# Altium schematic sheet Jumper.SchDoc
size Tabloid
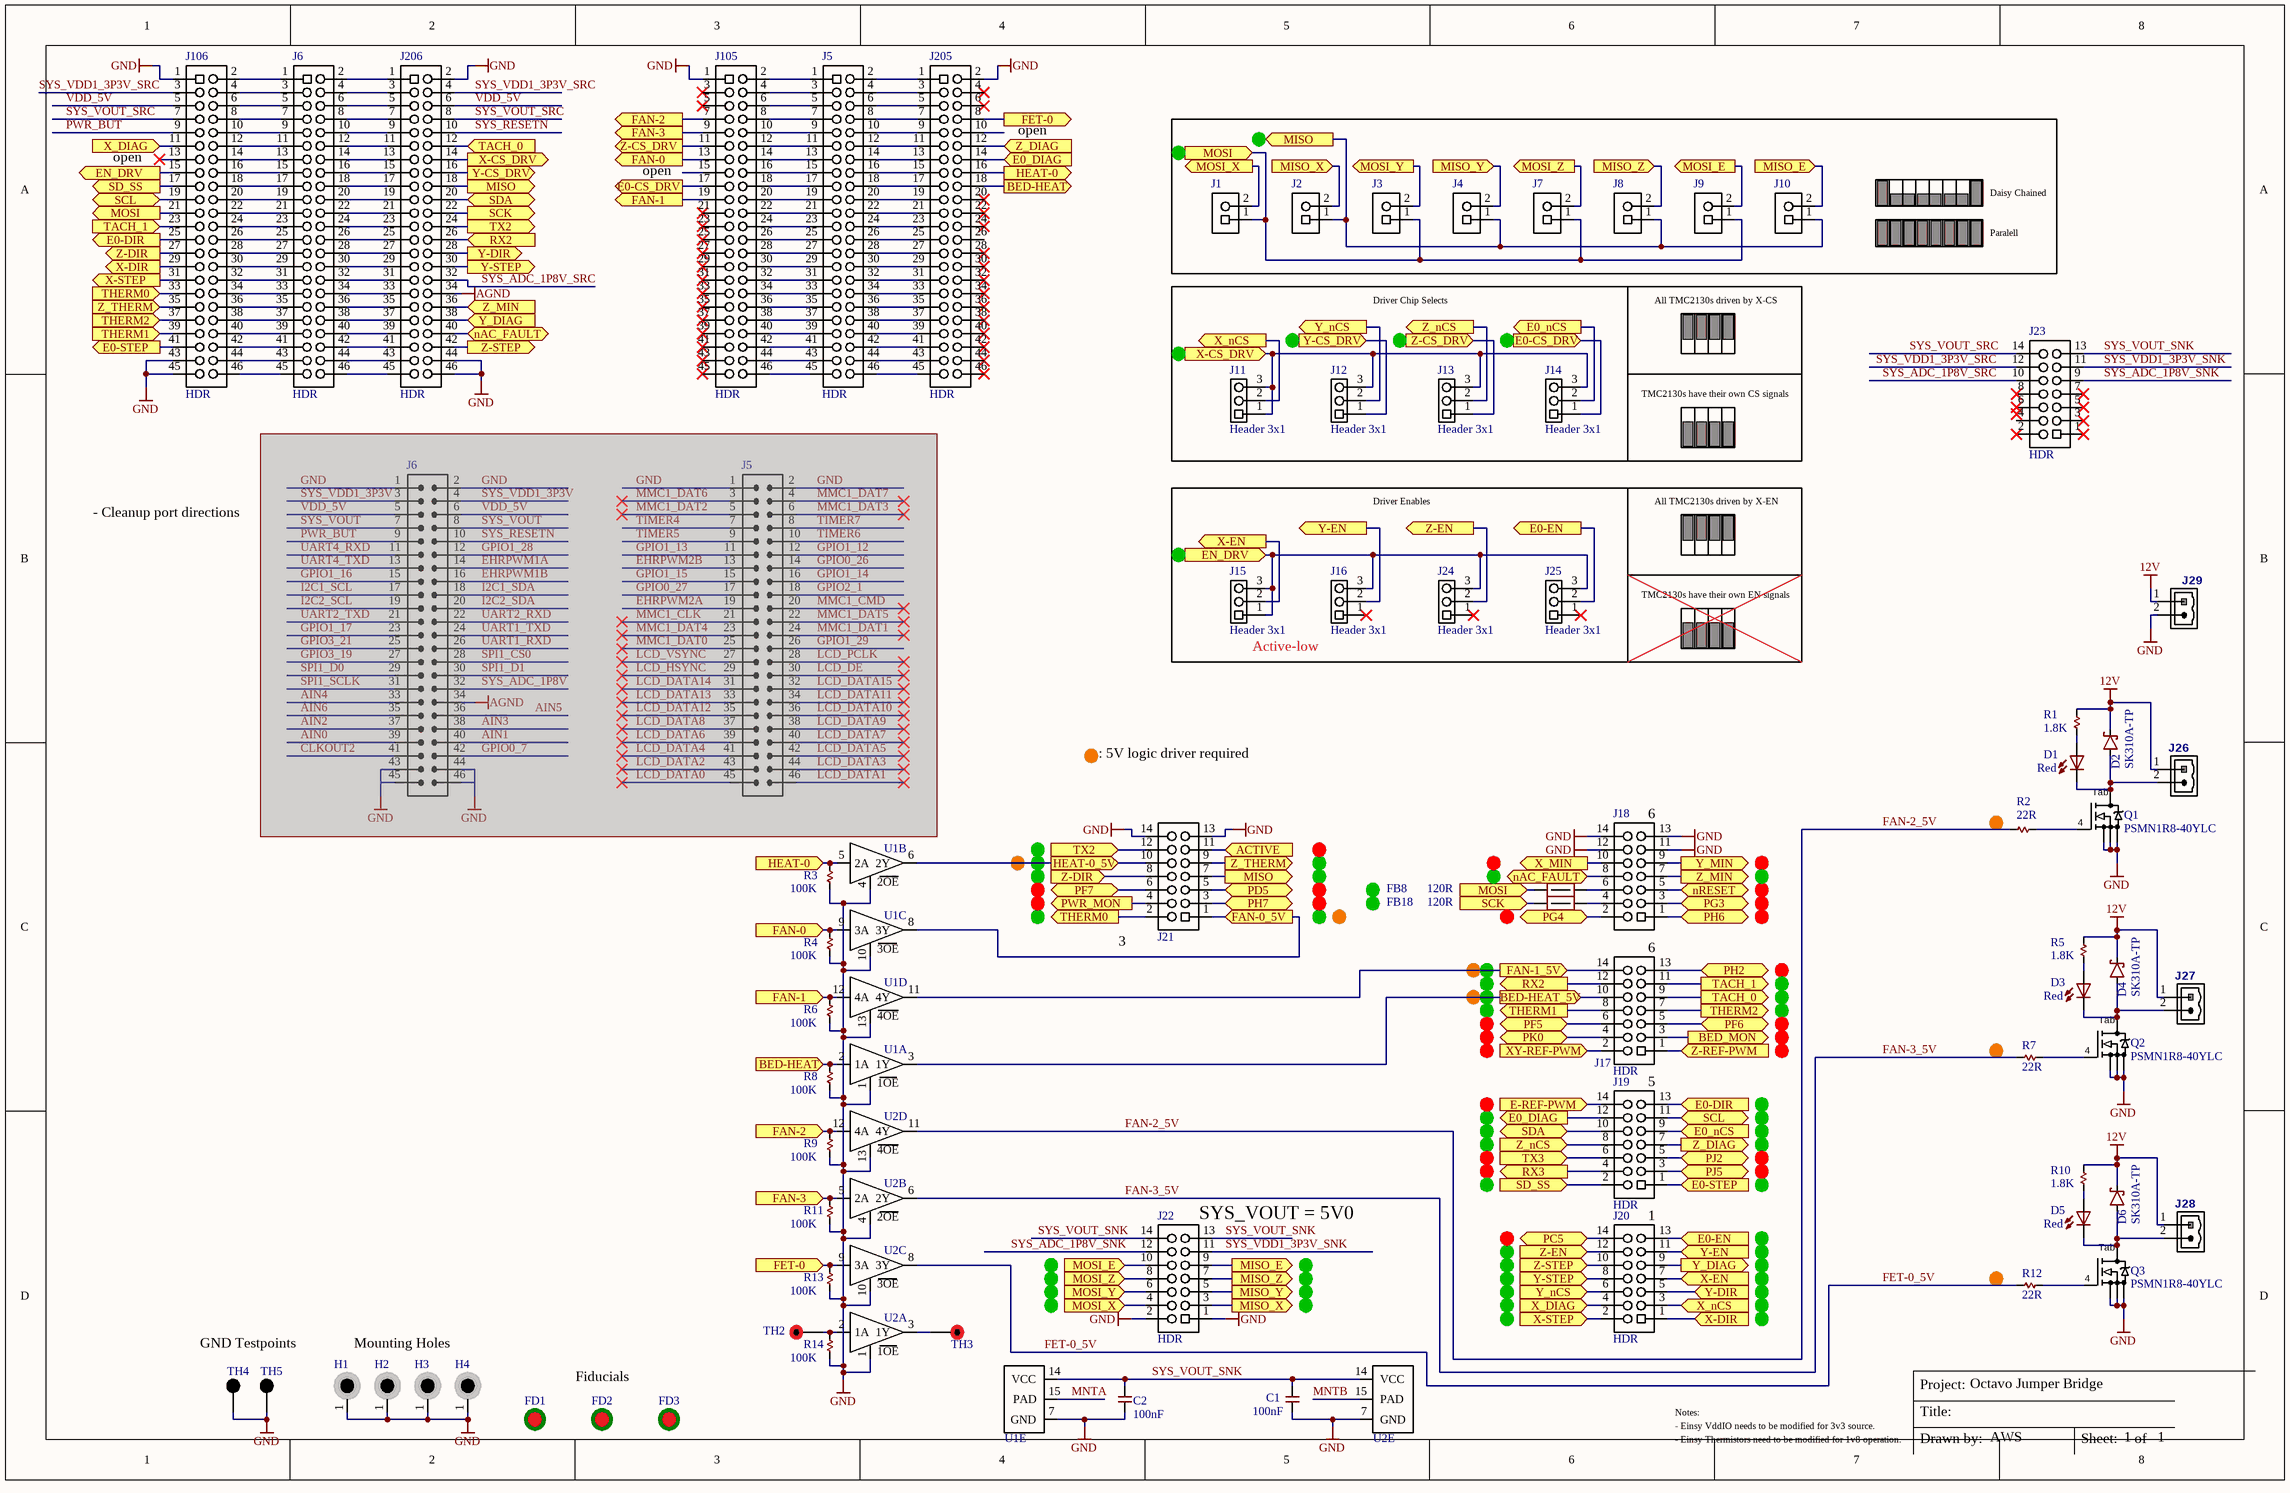
[diagram p0: Jumper.SchDoc]

## Parts
(Parts that share a designator on the sheet are numbered #1, #2 ... from top to bottom, then left to right.)
C1  100nF  [C0603]
C2  100nF  [C0603]
D1  Red  [LED2012120]
D2  SK310A-TP  [SMA-SM]
D3  Red  [LED2012120]
D4  SK310A-TP  [SMA-SM]
D5  Red  [LED2012120]
D6  SK310A-TP  [SMA-SM]
FB8  120R  [R0402]
FB18  120R  [R0402]
FD1  FIDUCIAL  [FIDUCIAL-1X2]  (value not drawn)
FD2  FIDUCIAL  [FIDUCIAL-1X2]  (value not drawn)
FD3  FIDUCIAL  [FIDUCIAL-1X2]  (value not drawn)
H1  Hole_DS  [Wave_hole_3x7-doubleSided]  (value not drawn)  (no BOM)
H2  Hole_DS  [Wave_hole_3x7-doubleSided]  (value not drawn)  (no BOM)
H3  Hole_DS  [Wave_hole_3x7-doubleSided]  (value not drawn)  (no BOM)
H4  Hole_DS  [Wave_hole_3x7-doubleSided]  (value not drawn)  (no BOM)
J1  Header 2x1  [HDR2X1]  (value not drawn)
J2  Header 2x1  [HDR2X1]  (value not drawn)
J3  Header 2x1  [HDR2X1]  (value not drawn)
J4  Header 2x1  [HDR2X1]  (value not drawn)
J5#1  HDR  [HDR2X23_ALT_PINOUT]
J5#2  HDR46  (value not drawn)  (masked out: inside a compile mask, not in the netlist)
J6#1  HDR  [HDR2X23_ALT_PINOUT]
J6#2  HDR46  (value not drawn)  (masked out: inside a compile mask, not in the netlist)
J7  Header 2x1  [HDR2X1]  (value not drawn)
J8  Header 2x1  [HDR2X1]  (value not drawn)
J9  Header 2x1  [HDR2X1]  (value not drawn)
J10  Header 2x1  [HDR2X1]  (value not drawn)
J11  Header 3x1  [HDR3X1]
J12  Header 3x1  [HDR3X1]
J13  Header 3x1  [HDR3X1]
J14  Header 3x1  [HDR3X1]
J15  Header 3x1  [HDR3X1]
J16  Header 3x1  [HDR3X1]
J17  HDR  [HDR2X7_ALT_PINOUT]
J18  HDR  [HDR2X7_ALT_PINOUT]  (value not drawn)
J19  HDR  [HDR2X7_ALT_PINOUT]
J20  HDR  [HDR2X7_ALT_PINOUT]
J21  HDR  [HDR2X7_ALT_PINOUT]  (value not drawn)
J22  HDR  [HDR2X7_ALT_PINOUT]
J23  HDR  [HDR2X7]
J24  Header 3x1  [HDR3X1]
J25  Header 3x1  [HDR3X1]
J26  0395311002  [MSTBV2]  (value not drawn)
J27  0395311002  [MSTBV2]  (value not drawn)
J28  0395311002  [MSTBV2]  (value not drawn)
J29  0395311002  [MSTBV2]  (value not drawn)
J105  HDR  [HDR2X23]
J106  HDR  [HDR2X23]
J205  HDR  [HDR2X23]
J206  HDR  [HDR2X23]
Q1  PSMN1R8-40YLC  [SOT669]
Q2  PSMN1R8-40YLC  [SOT669]
Q3  PSMN1R8-40YLC  [SOT669]
R1  1.8K  [R0603]
R2  22R  [R0805]
R3  100K  [R0402]
R4  100K  [R0402]
R5  1.8K  [R0603]
R6  100K  [R0402]
R7  22R  [R0805]
R8  100K  [R0402]
R9  100K  [R0402]
R10  1.8K  [R0603]
R11  100K  [R0402]
R12  22R  [R0805]
R13  100K  [R0402]
R14  100K  [R0402]
TH2  TP  [TH_28]  (value not drawn)
TH3  TP  [TH_28]  (value not drawn)
TH4  TH  [TP_80_150]  (value not drawn)  (no BOM)
TH5  TH  [TP_80_150]  (value not drawn)  (no BOM)
U1  SN74AHCT125RGYR  [QFN50P350X350X100_RGY_S-PVQFN-N14]  (value not drawn)  (parts A,B,C,D,E of 5)
U2  SN74AHCT125RGYR  [QFN50P350X350X100_RGY_S-PVQFN-N14]  (value not drawn)  (parts A,B,C,D,E of 5)

## Blocks framed on the sheet
Active-low: J15 J16 J24 J25

## Ports
ACTIVE, BED-HEAT, BED-HEAT_5V, BED_MON, E0-CS_DRV, E0-DIR, E0-EN, E0-STEP, E0_DIAG, E0_nCS, E-REF-PWM, EN_DRV, FAN-0, FAN-0_5V, FAN-1, FAN-1_5V, FAN-2, FAN-3, FET-0, HEAT-0, HEAT-0_5V, MISO, MISO_E, MISO_X, MISO_Y, MISO_Z, MOSI, MOSI_E, MOSI_X, MOSI_Y, MOSI_Z, nAC_FAULT, nRESET, PC5, PD5, PF5, PF6, PF7, PG3, PG4, PH2, PH6, PH7, PJ2, PJ5, PK0, PWR_MON, RX2, RX3, SCK, SCL, SD_SS, SDA, TACH_0, TACH_1, THERM0, THERM1, THERM2, TX2, TX3, X-CS_DRV, X-DIR, X-EN, X-STEP, X_DIAG, X_MIN, X_nCS, XY-REF-PWM, Y-CS_DRV, Y-DIR, Y-EN, Y-STEP, Y_DIAG, Y_MIN, Y_nCS, Z-CS_DRV, Z-DIR, Z-EN, Z-REF-PWM, Z-STEP, Z_DIAG, Z_MIN, Z_nCS, Z_THERM

## Nets
12V: D2.K D4.K D6.K J26.1 J27.1 J28.1 J29.1 R1.2 R5.2 R10.2
AGND: J206.34
GND: C1.1 C2.1 H1.1 H2.1 H3.1 H4.1 J18.11 J18.12 J18.13 J18.14 J21.13 J21.14 J22.1 J22.2 J29.2 J105.1 J106.1 J106.43 J106.45 J205.2 J206.2 J206.44 J206.46 Q1.1(S) Q1.2(S) Q1.3(S) Q2.1(S) Q2.2(S) Q2.3(S) Q3.1(S) Q3.2(S) Q3.3(S) R3.2 R4.2 R6.2 R8.2 R9.2 R11.2 R13.2 R14.2 TH4.1 TH5.1 U1.1(1OE) U1.4(2OE) U1.7(GND) U1.10(3OE) U1.13(4OE) U2.1(1OE) U2.4(2OE) U2.7(GND) U2.10(3OE) U2.13(4OE)
ACTIVE: J21.11 ; port ACTIVE
BED-HEAT: J205.18 R8.1 U1.2(1A) ; port BED-HEAT
BED-HEAT_5V: J17.10 U1.3(1Y) ; port BED-HEAT_5V
BED_MON: J17.3 ; port BED_MON
E0-CS_DRV: J14.1 J105.17 ; port E0-CS_DRV
E0-DIR: J19.13 J106.25 ; port E0-DIR
E0-EN: J20.13 J25.2 ; port E0-EN
E0-STEP: J19.1 J106.41 ; port E0-STEP
E0_DIAG: J19.12 J205.14 ; port E0_DIAG
E0_nCS: J14.2 J19.9 ; port E0_nCS
E-REF-PWM: J19.14 ; port E-REF-PWM
EN_DRV: J15.1 J15.3 J16.3 J24.3 J25.3 J106.15 ; port EN_DRV
FAN-0: J105.13 R4.1 U1.9(3A) ; port FAN-0
FAN-0_5V: J21.1 U1.8(3Y) ; port FAN-0_5V
FAN-1: J105.19 R6.1 U1.12(4A) ; port FAN-1
FAN-1_5V: J17.14 U1.11(4Y) ; port FAN-1_5V
FAN-2: J105.7 R9.1 U2.12(4A) ; port FAN-2
FAN-2_5V: R2.1 U2.11(4Y)
FAN-3: J105.9 R11.1 U2.5(2A) ; port FAN-3
FAN-3_5V: R7.1 U2.6(2Y)
FET-0: J205.8 R13.1 U2.9(3A) ; port FET-0
FET-0_5V: R12.1 U2.8(3Y)
HEAT-0: J205.16 R3.1 U1.5(2A) ; port HEAT-0
HEAT-0_5V: J21.10 U1.6(2Y) ; port HEAT-0_5V
MISO: J2.1 J4.1 J8.1 J10.1 J21.7 J206.18 ; port MISO
MISO_E: J10.2 J22.9 ; port MISO_E
MISO_X: J2.2 J22.3 ; port MISO_X
MISO_Y: J4.2 J22.5 ; port MISO_Y
MISO_Z: J8.2 J22.7 ; port MISO_Z
MNTA: U1.15(PAD)
MNTB: U2.15(PAD)
MOSI: FB8.2 J1.1 J3.1 J7.1 J9.1 J106.21 ; port MOSI
MOSI_E: J9.2 J22.10 ; port MOSI_E
MOSI_X: J1.2 J22.4 ; port MOSI_X
MOSI_Y: J3.2 J22.6 ; port MOSI_Y
MOSI_Z: J7.2 J22.8 ; port MOSI_Z
nAC_FAULT: J18.8 J206.40 ; port nAC_FAULT
nRESET: J18.5 ; port nRESET
PC5: J20.14 ; port PC5
PD5: J21.5 ; port PD5
PF5: J17.6 ; port PF5
PF6: J17.5 ; port PF6
PF7: J21.6 ; port PF7
PG3: J18.3 ; port PG3
PG4: J18.2 ; port PG4
PH2: J17.13 ; port PH2
PH6: J18.1 ; port PH6
PH7: J21.3 ; port PH7
PJ2: J19.5 ; port PJ2
PJ5: J19.3 ; port PJ5
PK0: J17.4 ; port PK0
PWR_BUT: J106.9
PWR_MON: J21.4 ; port PWR_MON
RX2: J17.12 J206.26 ; port RX2
RX3: J19.4 ; port RX3
SCK: FB18.2 J206.22 ; port SCK
SCL: J19.11 J106.19 ; port SCL
SD_SS: J19.2 J106.17 ; port SD_SS
SDA: J19.10 J206.20 ; port SDA
SYS_ADC_1P8V_SNK: J22.12 J23.9
SYS_ADC_1P8V_SRC: J23.10 J206.32
SYS_RESETN: J206.10
SYS_VDD1_3P3V_SNK: J22.11 J23.11
SYS_VDD1_3P3V_SRC: J23.12 J106.3 J206.4
SYS_VOUT_SNK: C1.2 C2.2 J22.13 J22.14 J23.13 U1.14(VCC) U2.14(VCC)
SYS_VOUT_SRC: J23.14 J106.7 J206.8
TACH_0: J17.9 J206.12 ; port TACH_0
TACH_1: J17.11 J106.23 ; port TACH_1
THERM0: J21.2 J106.33 ; port THERM0
THERM1: J17.8 J106.39 ; port THERM1
THERM2: J17.7 J106.37 ; port THERM2
TX2: J21.12 J206.24 ; port TX2
TX3: J19.6 ; port TX3
VDD_5V: J106.5 J206.6
X-CS_DRV: J11.1 J11.3 J12.3 J13.3 J14.3 J206.14 ; port X-CS_DRV
X-DIR: J20.1 J106.29 ; port X-DIR
X-EN: J15.2 J20.7 ; port X-EN
X-STEP: J20.2 J106.31 ; port X-STEP
X_DIAG: J20.4 J106.11 ; port X_DIAG
X_MIN: J18.10 ; port X_MIN
X_nCS: J11.2 J20.3 ; port X_nCS
XY-REF-PWM: J17.2 ; port XY-REF-PWM
Y-CS_DRV: J12.1 J206.16 ; port Y-CS_DRV
Y-DIR: J20.5 J206.28 ; port Y-DIR
Y-EN: J16.2 J20.11 ; port Y-EN
Y-STEP: J20.8 J206.30 ; port Y-STEP
Y_DIAG: J20.9 J206.38 ; port Y_DIAG
Y_MIN: J18.9 ; port Y_MIN
Y_nCS: J12.2 J20.6 ; port Y_nCS
Z-CS_DRV: J13.1 J105.11 ; port Z-CS_DRV
Z-DIR: J21.8 J106.27 ; port Z-DIR
Z-EN: J20.12 J24.2 ; port Z-EN
Z-REF-PWM: J17.1 ; port Z-REF-PWM
Z-STEP: J20.10 J206.42 ; port Z-STEP
Z_DIAG: J19.7 J205.12 ; port Z_DIAG
Z_MIN: J18.7 J206.36 ; port Z_MIN
Z_nCS: J13.2 J19.8 ; port Z_nCS
Z_THERM: J21.9 J106.35 ; port Z_THERM
NetD1_A: D1.A R1.1
NetD1_C: D1.C D2.A J26.2 Q1.TAB(D)
NetD3_A: D3.A R5.1
NetD3_C: D3.C D4.A J27.2 Q2.TAB(D)
NetD5_A: D5.A R10.1
NetD5_C: D5.C D6.A J28.2 Q3.TAB(D)
NetFB8_1: FB8.1 J18.6
NetFB18_1: FB18.1 J18.4
NetJ5#1_1: J5#1.1 J105.2
NetJ5#1_2: J5#1.2 J205.1
NetJ5#1_3: J5#1.3 J105.4
NetJ5#1_4: J5#1.4 J205.3
NetJ5#1_5: J5#1.5 J105.6
NetJ5#1_6: J5#1.6 J205.5
NetJ5#1_7: J5#1.7 J105.8
NetJ5#1_8: J5#1.8 J205.7
NetJ5#1_9: J5#1.9 J105.10
NetJ5#1_10: J5#1.10 J205.9
NetJ5#1_11: J5#1.11 J105.12
NetJ5#1_12: J5#1.12 J205.11
NetJ5#1_13: J5#1.13 J105.14
NetJ5#1_14: J5#1.14 J205.13
NetJ5#1_15: J5#1.15 J105.16
NetJ5#1_16: J5#1.16 J205.15
NetJ5#1_17: J5#1.17 J105.18
NetJ5#1_18: J5#1.18 J205.17
NetJ5#1_19: J5#1.19 J105.20
NetJ5#1_20: J5#1.20 J205.19
NetJ5#1_21: J5#1.21 J105.22
NetJ5#1_22: J5#1.22 J205.21
NetJ5#1_23: J5#1.23 J105.24
NetJ5#1_24: J5#1.24 J205.23
NetJ5#1_25: J5#1.25 J105.26
NetJ5#1_26: J5#1.26 J205.25
NetJ5#1_27: J5#1.27 J105.28
NetJ5#1_28: J5#1.28 J205.27
NetJ5#1_29: J5#1.29 J105.30
NetJ5#1_30: J5#1.30 J205.29
NetJ5#1_31: J5#1.31 J105.32
NetJ5#1_32: J5#1.32 J205.31
NetJ5#1_33: J5#1.33 J105.34
NetJ5#1_34: J5#1.34 J205.33
NetJ5#1_35: J5#1.35 J105.36
NetJ5#1_36: J5#1.36 J205.35
NetJ5#1_37: J5#1.37 J105.38
NetJ5#1_38: J5#1.38 J205.37
NetJ5#1_39: J5#1.39 J105.40
NetJ5#1_40: J5#1.40 J205.39
NetJ5#1_41: J5#1.41 J105.42
NetJ5#1_42: J5#1.42 J205.41
NetJ5#1_43: J5#1.43 J105.44
NetJ5#1_44: J5#1.44 J205.43
NetJ5#1_45: J5#1.45 J105.46
NetJ5#1_46: J5#1.46 J205.45
NetJ6#1_1: J6#1.1 J106.2
NetJ6#1_2: J6#1.2 J206.1
NetJ6#1_3: J6#1.3 J106.4
NetJ6#1_4: J6#1.4 J206.3
NetJ6#1_5: J6#1.5 J106.6
NetJ6#1_6: J6#1.6 J206.5
NetJ6#1_7: J6#1.7 J106.8
NetJ6#1_8: J6#1.8 J206.7
NetJ6#1_9: J6#1.9 J106.10
NetJ6#1_10: J6#1.10 J206.9
NetJ6#1_11: J6#1.11 J106.12
NetJ6#1_12: J6#1.12 J206.11
NetJ6#1_13: J6#1.13 J106.14
NetJ6#1_14: J6#1.14 J206.13
NetJ6#1_15: J6#1.15 J106.16
NetJ6#1_16: J6#1.16 J206.15
NetJ6#1_17: J6#1.17 J106.18
NetJ6#1_18: J6#1.18 J206.17
NetJ6#1_19: J6#1.19 J106.20
NetJ6#1_20: J6#1.20 J206.19
NetJ6#1_21: J6#1.21 J106.22
NetJ6#1_22: J6#1.22 J206.21
NetJ6#1_23: J6#1.23 J106.24
NetJ6#1_24: J6#1.24 J206.23
NetJ6#1_25: J6#1.25 J106.26
NetJ6#1_26: J6#1.26 J206.25
NetJ6#1_27: J6#1.27 J106.28
NetJ6#1_28: J6#1.28 J206.27
NetJ6#1_29: J6#1.29 J106.30
NetJ6#1_30: J6#1.30 J206.29
NetJ6#1_31: J6#1.31 J106.32
NetJ6#1_32: J6#1.32 J206.31
NetJ6#1_33: J6#1.33 J106.34
NetJ6#1_34: J6#1.34 J206.33
NetJ6#1_35: J6#1.35 J106.36
NetJ6#1_36: J6#1.36 J206.35
NetJ6#1_37: J6#1.37 J106.38
NetJ6#1_38: J6#1.38 J206.37
NetJ6#1_39: J6#1.39 J106.40
NetJ6#1_40: J6#1.40 J206.39
NetJ6#1_41: J6#1.41 J106.42
NetJ6#1_42: J6#1.42 J206.41
NetJ6#1_43: J6#1.43 J106.44
NetJ6#1_44: J6#1.44 J206.43
NetJ6#1_45: J6#1.45 J106.46
NetJ6#1_46: J6#1.46 J206.45
NetQ1_4: Q1.4(G) R2.2
NetQ2_4: Q2.4(G) R7.2
NetQ3_4: Q3.4(G) R12.2
NetR14_1: R14.1 TH2.1 U2.2(1A)
NetTH3_1: TH3.1 U2.3(1Y)

Not connected (* = marked no-connect by the designer): J16 1*; J23 1* 2* 3* 4 5* 6* 7* 8*; J24 1*; J25 1*; J105 3* 5* 15 21* 23* 25* 27* 29* 31* 33* 35* 37* 39* 41* 43* 45*; J106 13*; J205 4* 6* 10 20* 22* 24* 26 28* 30* 32* 34* 36* 38* 40* 42* 44* 46*

## Notes on the sheet
- (near J106) open
- (near J205) open
- (near J105) open
- Daisy Chained
- Driver Chip Selects
- All TMC2130s driven by X-CS
- Paralell
- TMC2130s have their own CS signals
- - Cleanup port directions
- Driver Enables
- All TMC2130s driven by X-EN
- TMC2130s have their own EN signals
- : 5V logic driver required
- (near J18) 6
- (near J21) 3
- 6
- 5
- (near J22) SYS_VOUT = 5V0
- 1
- GND Testpoints
- Mounting Holes
- Fiducials
- Notes:
- - Einsy VddIO needs to be modified for 3v3 source.
- Octavo Jumper Bridge
- - Einsy Thermistors need to be modified for 1v8 operation.
- AWS
- Title:
- Project:
- Drawn by:
- Sheet:
- of
- (in symbol PSMN1R8-40YLC) Tab

## Library data of the parts
C1 C2 = 100nF 0603 50V X7R: CAP CER 0603 100nF 50V 10% X7R; MANUFACTURER: Kemet; MANUFACTURER #: C0603C104K5RACTU; PART: 100nF 50V X7R 0603; PART DESCRIPTION: 0.10µF ±10% 50V Ceramic Capacitor X7R 0603 (1608 Metric); DISTRIBUTOR #: 399-5089-2-ND; DISTRIBUTOR: Digikey; TOLERANCE: 10%; EE_SPEC: 50V; VALUE: 100nF
D1 D3 D5 = 5988110107F: LED 0805 Red; MANUFACTURER: Dialight; PART: LED Red 0805; PART DESCRIPTION: Red 635nm LED Indication - Discrete 2.2V 0805 (2012 Metric); TOLERANCE: -NA-; EE_SPEC: Vf=2.2V; VALUE: Red; MANUFACTURER #: 5988110107F; DISTRIBUTOR #: 350-2038-2-ND; DISTRIBUTOR: Digikey
D2 D4 D6 = SK310A: DIODE Schottky 3A SMA; MANUFACTURER: MCC; PART: Schottky Diode 100V 3A; PART DESCRIPTION: Diode Schottky 100V 3A Surface Mount DO-214AC (HSMA); TOLERANCE: -NA-; VALUE: -NA-; EE_SPEC: 100V 3A; MANUFACTURER #: SK310A; DISTRIBUTOR #: SK310A-TPTR-ND; DISTRIBUTOR: Digikey
FB8 FB18 = FERRITE 120R 1A 0402: FERRITE BEAD 120 OHM 0402 1LN; MANUFACTURER: Taiyo Yuden; MANUFACTURER #: BKP1005HS121-T; VALUE: 120Rfb; TOLERANCE: -NA-; EE_SPEC: 1A; DISTRIBUTOR #: 587-1921-2-ND; DISTRIBUTOR: Digikey; PART: FERRITE 120R 1A 0402; PART DESCRIPTION: FERRITE BEAD 120 OHM 0402 1LN
FD1-FD3 = FIDUCIAL: MANUFACTURER #: NOTAPART-Fiducial
H1-H4 = Hole_DS: MANUFACTURER #: NOTAPART-Hole
J1-J4 J7-J10 = Header 2x1: Header 2Pin 1Row T-Hole; MANUFACTURER #: 2211S-02G; MANUFACTURER: Multicomp; PART: CONN 2Pin 1Row 0.1"; PART DESCRIPTION: MULTICOMP  2211S-02G  Board-To-Board Connector, 2.54 mm, 2 Contacts, Header, 2211S Series, Through Hole, 1 Rows; TOLERANCE: -NA-; VALUE: JMP; DISTRIBUTOR #: 08N6744; DISTRIBUTOR: Newark; EE_SPEC: -NA-
J5#1 J6#1 J105 J106 J205 J206 = Header 2X23 Male Pin: CONN HEADER .100" DUAL STR 46POS; MANUFACTURER #: PRPC023DAAN-RC; MANUFACTURER: Sullins; PART DESCRIPTION: 46 Positions Header, Breakaway Connector 0.100" (2.54mm) Through Hole Gold; TOLERANCE: -NA-; DISTRIBUTOR #: S2011EC-23-ND; DISTRIBUTOR: Newark; VALUE: HDR; EE_SPEC: -NA-
J5#2 J6#2 = CONN 46PIN 0.1" FEMALE DUAL-ROW T-HOLE VERT: MANUFACTURER #: NOTAPART - CONN PLACE HOLDER
J11-J16 J24 J25 = Header 3x1 Male Pin: Header 3Pin 1Row T-Hole; MANUFACTURER #: 2211S-03G; MANUFACTURER: Multicomp; PART: CONN 3Pin 1Row 0.1"; PART DESCRIPTION: MULTICOMP  2211S-03G  Board-To-Board Connector, 2.54 mm, 3 Contacts, Header, 2211S Series, Through Hole, 1 Rows; TOLERANCE: -NA-; VALUE: JMP; DISTRIBUTOR #: 08N6745; DISTRIBUTOR: Newark; EE_SPEC: -NA-
J17-J23 = Header 2X7 Male Pin: CONN HEADER .100" DUAL STR 14POS; MANUFACTURER #: PRPC007DAAN-RC; MANUFACTURER: Sullins; PART DESCRIPTION: 14 Positions Header, Breakaway Connector 0.100" (2.54mm) Through Hole Gold; TOLERANCE: -NA-; DISTRIBUTOR #: S2011EC-07-ND; DISTRIBUTOR: Newark; VALUE: HDR; EE_SPEC: -NA-
J26-J29 = 0395311002: Conn - 5.08mm Pitch Fixed; MANUFACTURER: Molex; PART: 2POS; Part Description: 2 Position Terminal Block Header, Male Pins, Shrouded (4 Side) 0.200" (5.08mm) Vertical Through Hole; EE_SPEC: 300V 15A 0.2"; Tolerance: NA; Value: 0395311002; DISTRIBUTOR #: WM7837-ND; DISTRIBUTOR: Digi-Key; MANUFACTURER #: 0395311002
Q1-Q3 = PSMN1R8-40YLC: MOSFET N-CH 40V 100A LFPAK; MANUFACTURER: Nexperia; MANUFACTURER #: PSMN1R8-40YLC,115; PART: N-FET; PART DESCRIPTION: N-Channel 40V 100A (Tc) 272W (Tc) Surface Mount LFPAK56, Power-SO8; TOLERANCE: -NA-; VALUE: N-FET; EE_SPEC: 40V 100A 1.8mOhm; DISTRIBUTOR #: 1727-1052-2-ND; DISTRIBUTOR: Digikey
R1 R5 R10 = 1.8k 5% 0603: RES 0603 1.8K 100mW 5%; MANUFACTURER: Yageo; MANUFACTURER #: RC0603JR-071K8L; PART DESCRIPTION: 1.8k Ohm ±5% 0.1W, 1/10W Chip Resistor 0603 (1608 Metric) Moisture Resistant Thick Film; EE_SPEC: 1/10W; DISTRIBUTOR #: 311-1.8KGRTR-ND; DISTRIBUTOR: Digikey; PART: 1.8k 5% 0603; TOLERANCE: 5%; VALUE: 1.8K
R2 R7 R12 = 22R 1% 0805: RES SMD 22 OHM 1% 1/8W 0805; MANUFACTURER: Yageo; MANUFACTURER #: RC0805FR-0722RL; Part Description: ±1% 0.125W, 1/8W Chip Resistor 0805 (2012 Metric) Moisture Resistant Thick Film; Tolerance: +/- 1%; DISTRIBUTOR #: 311-22.0CRTR-ND; DISTRIBUTOR: Digi-Key; EE_SPEC: 22R 1% 0805; PART: RES SMD 22 OHM 1% 1/8W 0805; VALUE: 22R
R3 R4 R6 R8 R9 R11 R13 R14 = 100k 1% 0402: RES SMD 100K OHM 1% 1/16W 0402; MANUFACTURER: Samsung; MANUFACTURER #: RC1005F104CS; PART DESCRIPTION: 100k Ohm ±1% 0.063W, 1/16W Chip Resistor 0402 (1005 Metric) Moisture Resistant Thick Film; DISTRIBUTOR #: 1276-3432-1-ND; DISTRIBUTOR: Digikey; PART: 100k 1% 0402; TOLERANCE: 1%; EE_SPEC: 1/16W; VALUE: 100K
TH2 TH3 = TH TP 28 40: TESTPOINT 28 40; PART: TESTPOINT; COST: NA
TH4 TH5 = TH 85mil: THRUHOLE 85mil; PART: THRUHOLE; COST: NA
U1 U2 = SN74AHCT125: Quadruple Bus Buffer Gates With 3-State Outputs 14-VQFN -40 to 125; MANUFACTURER: Texas Instruments; PART: IC BUS BUFFER TRI-ST QD 14VQFN; PART DESCRIPTION: Buffer, Non-Inverting 4 Element 1 Bit per Element Push-Pull Output 14-VQFN (3.5x3.5); TOLERANCE: -NA-; VALUE: Tri-State Buffer; EE_SPEC: 5V 8mA; MANUFACTURER #: SN74AHCT125RGYR; DISTRIBUTOR #: 296-13910-2-ND; DISTRIBUTOR: Digikey